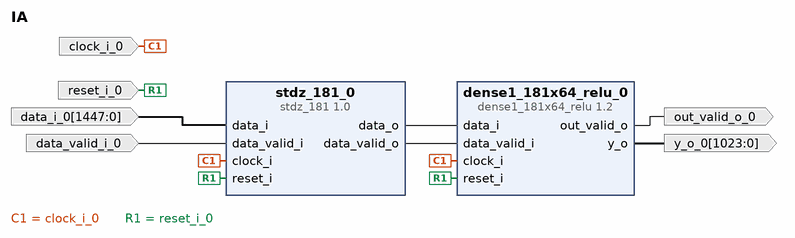
[diagram p0: block diagram of the top level]
# Vivado block design IA, xc7vx485tffg1157-1, Vivado 2024.2
create_bd_design IA

create_bd_port -dir I -type clk clock_i_0
create_bd_port -dir I -type rst reset_i_0
create_bd_port -dir I data_valid_i_0
create_bd_port -dir I -from 1447 -to 0 data_i_0
create_bd_port -dir O out_valid_o_0
create_bd_port -dir O -from 1023 -to 0 y_o_0

create_bd_cell -type ip -vlnv xilinx.com:user:stdz_181:1.0 stdz_181_0
create_bd_cell -type ip -vlnv xilinx.com:user:dense1_181x64_relu:1.2 dense1_181x64_relu_0

# ---- connections ----

connect_bd_net -net clock_i_0_1 [get_bd_ports clock_i_0] [get_bd_pins stdz_181_0/clock_i] [get_bd_pins dense1_181x64_relu_0/clock_i]
connect_bd_net -net data_i_0_1 [get_bd_ports data_i_0] [get_bd_pins stdz_181_0/data_i]
connect_bd_net -net data_valid_i_0_1 [get_bd_ports data_valid_i_0] [get_bd_pins stdz_181_0/data_valid_i]
connect_bd_net [get_bd_pins dense1_181x64_relu_0/out_valid_o] [get_bd_ports out_valid_o_0]
connect_bd_net [get_bd_pins dense1_181x64_relu_0/y_o] [get_bd_ports y_o_0]
connect_bd_net -net reset_i_0_1 [get_bd_ports reset_i_0] [get_bd_pins stdz_181_0/reset_i] [get_bd_pins dense1_181x64_relu_0/reset_i]
connect_bd_net [get_bd_pins stdz_181_0/data_o] [get_bd_pins dense1_181x64_relu_0/data_i]
connect_bd_net [get_bd_pins stdz_181_0/data_valid_o] [get_bd_pins dense1_181x64_relu_0/data_valid_i]

validate_bd_design
save_bd_design
